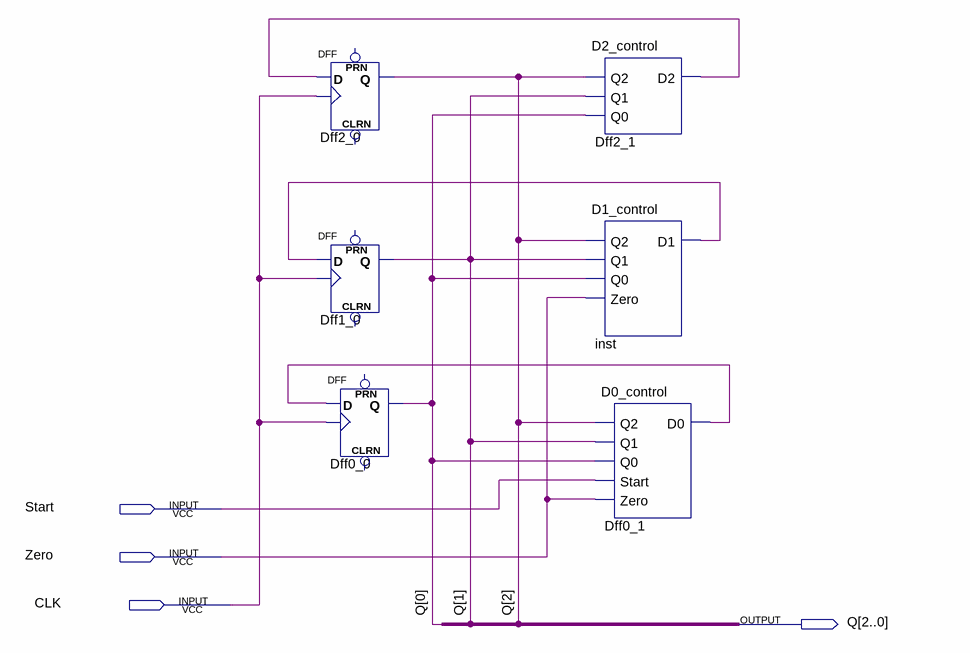
[diagram p0: schematic sheet]
// Quartus schematic Start_Zero.bdf as structural Verilog: 6 symbols, 4 pins
module Start_Zero (
  input  Start,
  input  Zero,
  input  CLK,
  output [2:0] Q
);

  wire Dff0_1_d0, Dff2_1_d2, inst_d1;

  DFF Dff2_0 (.CLK(CLK), .D(Dff2_1_d2), .Q(Q[2]));  // open: CLRN, PRN
  DFF Dff1_0 (.CLK(CLK), .D(inst_d1), .Q(Q[1]));  // open: CLRN, PRN
  DFF Dff0_0 (.CLK(CLK), .D(Dff0_1_d0), .Q(Q[0]));  // open: CLRN, PRN
  D2_control Dff2_1 (.Q2(Q[2]), .Q1(Q[1]), .Q0(Q[0]), .D2(Dff2_1_d2));
  D1_control inst (.Q2(Q[2]), .Q1(Q[1]), .Q0(Q[0]), .Zero(Zero), .D1(inst_d1));
  D0_control Dff0_1 (.Q2(Q[2]), .Q1(Q[1]), .Q0(Q[0]), .Start(Start), .Zero(Zero), .D0(Dff0_1_d0));
endmodule
